# EAGLE design Sony PS Vita USB-C (EAGLE 6.2)
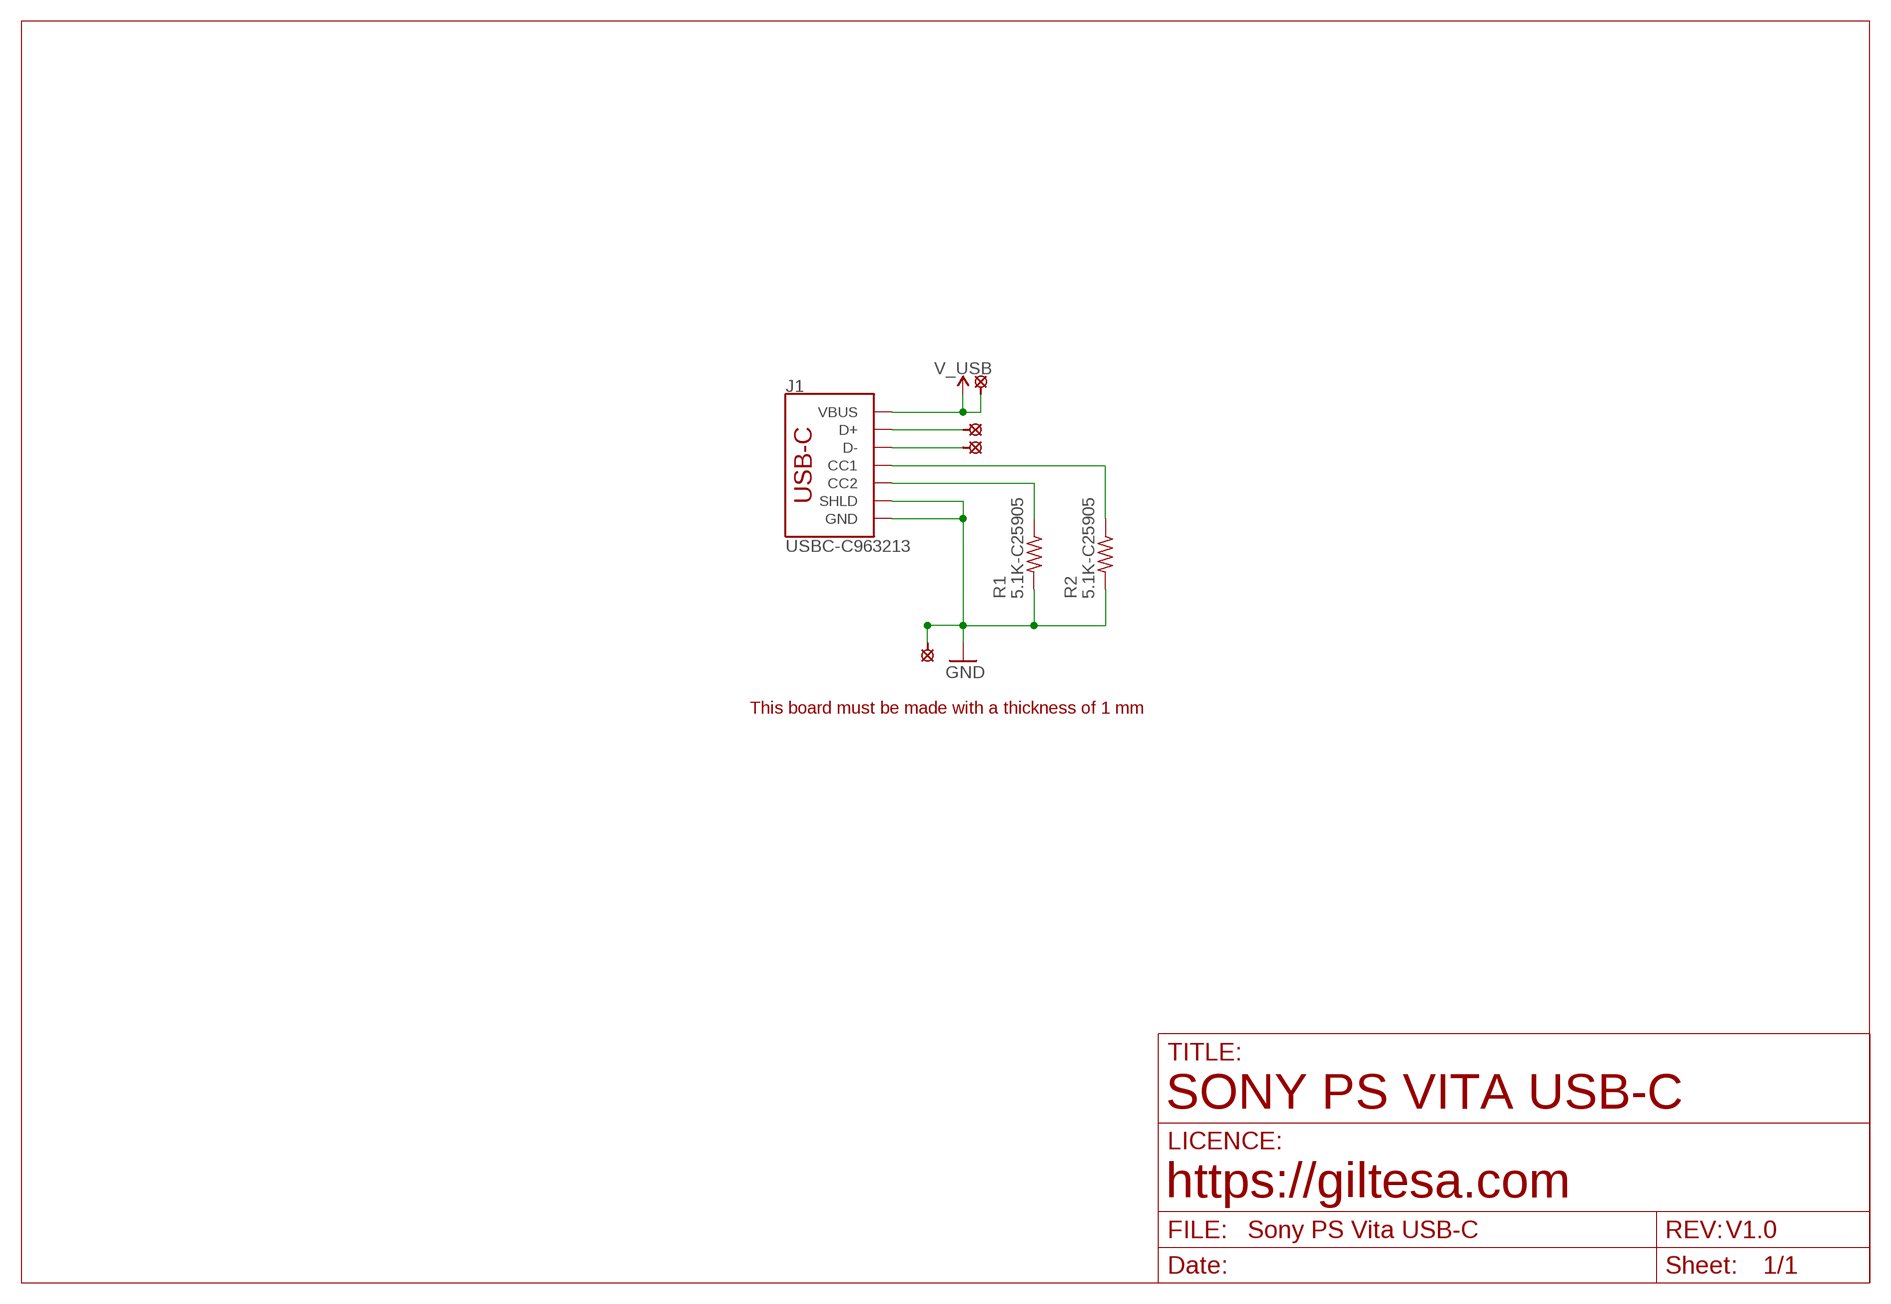
[diagram p0: schematic, sheet 1]

## Parts
J1  USBC-C963213  USB-C_16P_DATA_SLIM  [USB-C_18P_SLIM_GT-USB-7025]
R1  5.1K-C25905  R0402  [R0402]
R2  5.1K-C25905  R0402  [R0402]
U$3  SOLDER_PAD-1.5  [SOLDER_PAD_1.5]
U$4  PAD_1.0  [PAD_1.0]
U$5  SOLDER_PAD-1.5  [SOLDER_PAD_1.5]
U$6  SOLDER_PAD-1.5  [SOLDER_PAD_1.5]
U$7  PAD_1.0  [PAD_1.0]
U$8  PAD_1.0  [PAD_1.0]
U$9  PAD_1.0  [PAD_1.0]

## Nets
CC1: J1.A5-CC1(CC1) R2.1
CC2: J1.B5-CC2(CC2) R1.1
D+: J1.A6-DP1(D+) J1.B6-DP2(D+) U$5.P$1
D-: J1.A7-DN1(D-) J1.B7-DN2(D-) U$6.P$1
GND: J1.A1-GND(GND) J1.A12-GND(GND) J1.B1-GND(GND) J1.B12-GND(GND) J1.GND1(GND) J1.GND2(GND) J1.SHLD1(SHLD) J1.SHLD2(SHLD) J1.SHLD3(SHLD) J1.SHLD4(SHLD) R1.2 R2.2 U$4.P$1 U$7.P$1 U$8.P$1 U$9.P$1
V_USB: J1.A4-VBUS(VBUS) J1.A9-VBUS(VBUS) J1.B4-VBUS(VBUS) J1.B9-VBUS(VBUS) U$3.P$1

## Notes on the sheet
- This board must be made with a thickness of 1 mm
- SONY PS VITA USB-C
- https://giltesa.com
- V1.0

## Library data of the parts
J1 = ,giltesa:USB-C_16P
R1 R2 = ,giltesa:R0402
U$3 U$5 U$6 = ,giltesa:SOLDER_PAD
U$4 U$7-U$9 = ,giltesa:PAD

## Net classes
1 power: width 0.61 mm, drill 0.406 mm, clearance 0.203 mm
2 gnd: width 0.305 mm, drill 0.406 mm, clearance 0.203 mm
3 power usb: width 0.508 mm, drill 0.406 mm, clearance 0.203 mm

## Board
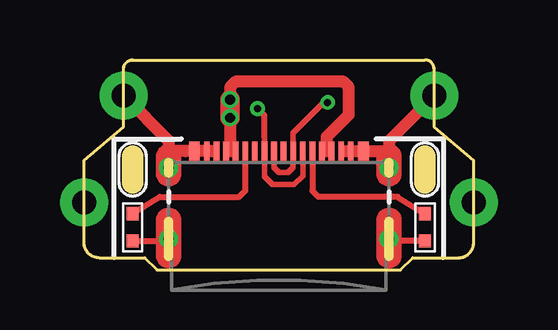
[diagram p1: board, top side]
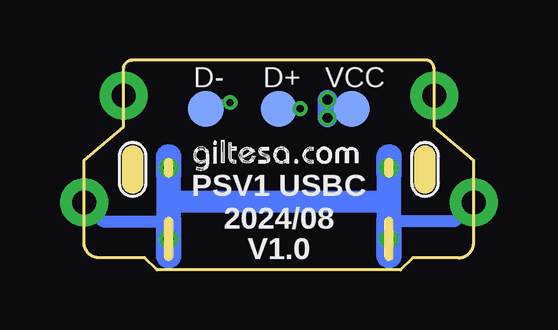
[diagram p2: board, bottom side, seen from below]

Size 16.26 x 8.76 mm. Coordinates in mm from the lower left corner, seen from the top.
Outline: 0,1.14 0,4.57 1.65,5.97 1.65,8.38 arc-90 2.03,8.76 14.22,8.76 arc-90 14.61,8.38 14.61,5.97 16.26,4.57 16.26,1.14 arc-90 15.62,0.51 13.72,0.51 13.21,0 3.05,0 2.54,0.51 0.63,0.51 arc-90 0,1.14
Copper layers (1*16): Top 0.035mm / dielectric 1.6mm / Bottom 0.035mm
Design rules: minimum track width 6mil, minimum drill 12mil, track to track 6mil, track to pad 6mil, pad to pad 6mil, via to via 8mil, smd to smd 0mil, copper to edge 20mil, drill to drill 10mil, minimum pad ring 6mil, minimum via ring 6mil, stop-mask expansion 0mil, vias tented up to drill 100mil, thermal gap 10mil

### Footprints (pad centres in the part's own frame; a part is rotated, then mirrored left to right if it is on the bottom)
USB-C_18P_SLIM_GT-USB-7025 = smd 0.24 x 0.8: A1-GND -3,1.845; A4-VBUS -2.2,1.845; A5-CC1 -1.4,1.845; A6-DP1 -0.6,1.845; A7-DN1 -0.2,1.845; A8-SBU1 0.2,1.845; A9-VBUS 1.8,1.845; A12-GND 2.6,1.845; B1-GND 3,1.845; B4-VBUS 2.2,1.845; B5-CC2 1.4,1.845; B6-DP2 1,1.845; B7-DN2 0.6,1.845; B8-SBU2 -1,1.845; B9-VBUS -1.8,1.845; B12-GND -2.6,1.845 | smd 0.45 x 0.8: GND1 -3.525,1.845; GND2 3.525,1.845 | drill 0.4 pad 0.8: SHLD1 -4.595,1.155; SHLD2 4.595,1.155; SHLD3 -4.595,-1.815; SHLD4 4.595,-1.815
R0402 = smd 0.559 x 0.5: 1 -0.567,0; 2 0.567,0
PS_VITA_HOLE = hole 0.584: 0,0
SOLDER_PAD_1.5 = smd 1.5 x 1.5: P$1 0,0
PAD_1.0 = drill 1 pad 2: P$1 0,0

### Placement (x,y rotation side)
J1  8.13,3.11 0 top
R1  14.22,1.78 270 top
R2  2.03,1.78 270 top
U$1  [PS_VITA_HOLE]  2.03,4.19 0 top
U$3  5.08,6.73 0 bottom
U$4  0,2.82 270 top
U$5  8.13,6.73 0 bottom
U$6  11.18,6.73 0 bottom
U$7  1.65,7.27 270 top
U$8  14.61,7.27 90 top
U$9  16.26,2.82 90 top
U$10  [PS_VITA_HOLE]  14.22,4.19 0 top
U$11  [GILTESA.COM_MASK_7MM]  11.73,4.06 0 bottom

### Tracks (layer width: path | path; a pad name or v marks a point on that pad's centre or on a via)
CC1
  Top 0.254: 2.09,2.34 R2.1 3.17,3.05 6.48,3.05 6.73,3.3 J1.A5-CC1
CC2
  Top 0.254: 14.16,2.34 R1.1 13.08,3.05 9.78,3.05 9.53,3.3 J1.B5-CC2
D+  (via drill 0.3)
  Top 0.239: J1.B6-DP2 9.13,3.92 8.76,3.56 7.87,3.56 7.53,3.9 J1.A6-DP1 7.53,5.55
  Top 0.254: 7.53,5.55 7.53,6.44 v7.24,6.73
  Bottom 0.254: U$5.P$1 v7.24,6.73
D-  (via drill 0.3)
  Top 0.239: J1.A7-DN1 7.93,4.26 8.13,4.06 8.51,4.06 8.73,4.28 J1.B7-DN2 8.73,5.71
  Top 0.254: 8.73,5.71 10,6.99 v10.16,6.99
  Bottom 0.254: v10.16,6.99 11.18,6.99 U$6.P$1
GND
  Top 0.229: J1.B12-GND 5.33,4.95 | J1.A12-GND 10.92,4.95
  Top 0.254: R1.2 12.81,1.21 J1.SHLD4 | R2.2 3.45,1.21 J1.SHLD3
  Top 0.508: 10.92,4.95 J1.B1-GND J1.GND2 12.03,4.95 12.72,4.95 | 5.33,4.95 J1.A1-GND J1.GND1 4.22,4.95 3.53,4.95 | U$7.P$1 3.53,5.38 3.53,4.95 | 3.53,4.95 J1.SHLD1 | U$8.P$1 12.72,5.38 12.72,4.95 | 12.72,4.95 J1.SHLD2
  Bottom 0.508: U$4.P$1 0.79,2.03 3.53,2.03 | U$9.P$1 15.47,2.03 12.72,2.03
  Bottom 0.914: 3.53,2.85 12.72,2.85
  Bottom 1.016: J1.SHLD1 3.53,2.85 3.53,2.03 J1.SHLD3 | J1.SHLD4 12.72,2.03 12.72,2.85 J1.SHLD2
V_USB  (via drill 0.41)
  Top 0.229: J1.B4-VBUS 10.13,4.95 J1.A9-VBUS | J1.B9-VBUS 6.12,4.95 J1.A4-VBUS
  Top 0.508: 6.12,4.95 6.12,6.33 v6.1,6.35 | 10.13,4.95 10.13,5.56 11.05,6.48 11.05,7.62 10.79,7.87 6.35,7.87 6.1,7.62 v6.1,7.11
  Top 0.813: v6.1,6.35 v6.1,7.11
  Bottom 0.508: U$3.P$1 6.1,6.73 v6.1,6.35
  Bottom 0.813: v6.1,6.35 v6.1,7.11

### Text on the board
bPlace: VCC | D+ | D- | PSV1 USBC | 2024/08 | V1.0